# Altium project SIM.PrjPCB
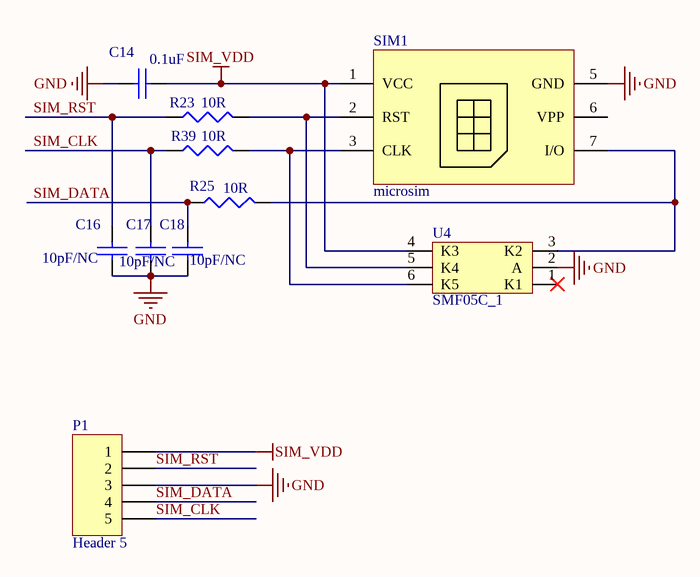
[diagram p0: Sheet1.SchDoc]
1 sheet, 10 parts. Net scope: global (net labels, ports and power ports of the same name join across sheets).
Board file: PCB1.PcbDoc

## Sheet Sheet1.SchDoc
size A4

### Parts
C14  0.1uF  [0402C]
C16  10pF/NC  [0402C]
C17  10pF/NC  [0402C]
C18  10pF/NC  [0402C]
P1  Header 5  [5×1.25mmSMT]
R23  10R  [0402R]
R25  10R  [0402R]
R39  10R  [0402R]
SIM1  microsim  [Nano SIM]
U4  SMF05C_1  [SC70-6L]

### Nets
GND: C14.1 C16.1 C17.1 C18.1 P1.3 SIM1.5(GND) U4.2(A)
SIM_VDD: C14.2 P1.1 SIM1.1(VCC) U4.4(K3)
SIM_CLK: C17.2 P1.5 R39.1
SIM_DATA: C18.2 P1.4 R25.1
SIM_RST: C16.2 P1.2 R23.1
NetR23_2: R23.2 SIM1.2(RST) U4.5(K4)
NetR25_2: R25.2 SIM1.7(I/O) U4.3(K2)
NetR39_2: R39.2 SIM1.3(CLK) U4.6(K5)

Not connected (* = marked no-connect by the designer): SIM1 6(VPP); U4 1(K1)*

### Library data of the parts
C14 C16-C18 = CAP: Capacitor
P1 = Header 5: Header, 5-Pin; LatestRevisionDate: 17-Jul-2002; LatestRevisionNote: Re-released for DXP Platform.; Publisher: Altium Limited
R23 R25 R39 = RES1: P: 1/8W
U4 = SMF05C_1: TVS